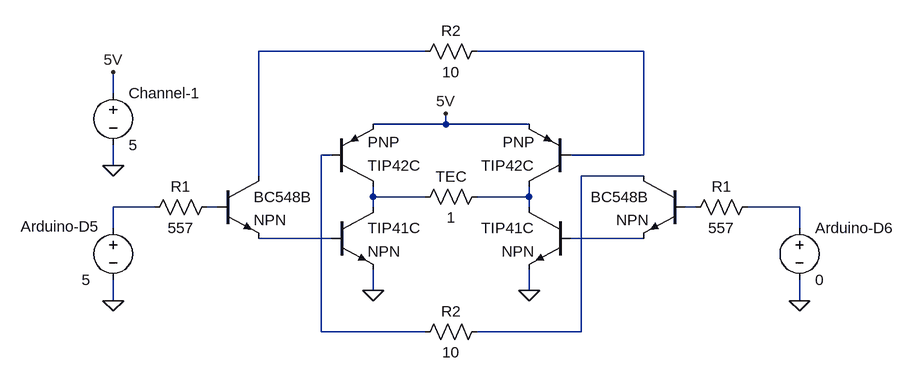
[diagram p0: schematic H Bridge - Print.asc]
H Bridge - Print.asc, the LTspice schematic file:
Version 4
SHEET 1 960 680
WIRE 160 -64 -96 -64
WIRE 496 -64 240 -64
WIRE -320 0 -320 -32
WIRE 192 48 192 32
WIRE 192 48 80 48
WIRE 320 48 192 48
WIRE 16 96 0 96
WIRE 496 96 496 -64
WIRE 496 96 384 96
WIRE -320 112 -320 80
WIRE -96 128 -96 -64
WIRE 496 128 400 128
WIRE 80 160 80 144
WIRE 160 160 80 160
WIRE 320 160 320 144
WIRE 320 160 240 160
WIRE -256 176 -320 176
WIRE -160 176 -176 176
WIRE 80 176 80 160
WIRE 320 176 320 160
WIRE 576 176 560 176
WIRE 736 176 656 176
WIRE -320 208 -320 176
WIRE 736 208 736 176
WIRE 16 224 -96 224
WIRE 496 224 384 224
WIRE 80 304 80 272
WIRE 320 304 320 272
WIRE -320 320 -320 288
WIRE 736 320 736 288
WIRE 0 368 0 96
WIRE 160 368 0 368
WIRE 400 368 400 128
WIRE 400 368 240 368
FLAG 80 304 0
FLAG 320 304 0
FLAG 736 320 0
FLAG -320 320 0
FLAG -320 112 0
FLAG -320 -32 5V
FLAG 192 32 5V
SYMBOL npn 16 176 R0
SYMATTR InstName TIP41C
SYMBOL npn 384 176 M0
SYMATTR InstName TIP41C
SYMBOL npn -160 128 R0
SYMATTR InstName BC548B
SYMBOL npn 560 128 M0
SYMATTR InstName BC548B
SYMBOL pnp 16 144 M180
SYMATTR InstName TIP42C
SYMBOL pnp 384 144 R180
SYMATTR InstName TIP42C
SYMBOL res 256 144 R90
WINDOW 0 0 56 VBottom 2
WINDOW 3 32 56 VTop 2
SYMATTR InstName TEC
SYMATTR Value 1
SYMBOL res -160 160 R90
WINDOW 0 0 56 VBottom 2
WINDOW 3 32 56 VTop 2
SYMATTR InstName R1
SYMATTR Value 557
SYMBOL res 672 160 R90
WINDOW 0 0 56 VBottom 2
WINDOW 3 32 56 VTop 2
SYMATTR InstName R1
SYMATTR Value 557
SYMBOL voltage -320 192 R0
WINDOW 123 0 0 Left 2
WINDOW 39 0 0 Left 2
WINDOW 0 -142 14 Left 2
WINDOW 3 -48 96 Left 2
SYMATTR InstName Arduino-D5
SYMATTR Value 5
SYMBOL voltage 736 192 R0
SYMATTR InstName Arduino-D6
SYMATTR Value 0
SYMBOL res 256 -80 R90
WINDOW 0 0 56 VBottom 2
WINDOW 3 32 56 VTop 2
SYMATTR InstName R2
SYMATTR Value 10
SYMBOL voltage -320 -16 R0
SYMATTR InstName Channel-1
SYMATTR Value 5
SYMBOL res 256 352 R90
WINDOW 0 0 56 VBottom 2
WINDOW 3 32 56 VTop 2
SYMATTR InstName R2
SYMATTR Value 10

The netlist it stands for:
* H Bridge - Print.asc
Q§TIP41C N005 N011 0 0 NPN
Q§TIP41C N006 N012 0 0 NPN
Q§BC548B N001 N008 N011 0 NPN
Q§BC548B N004 N009 N012 0 NPN
Q§TIP42C N005 N003 5V 0 PNP
Q§TIP42C N006 N002 5V 0 PNP
R§TEC N006 N005 1
R1 N008 N007 557
R1 N010 N009 557
V§Arduino-D5 N007 0 5
V§Arduino-D6 N010 0 0
R2 N002 N001 10
V§Channel-1 5V 0 5
R2 N004 N003 10
.model NPN NPN
.model PNP PNP
.lib standard.bjt
.backanno
.end